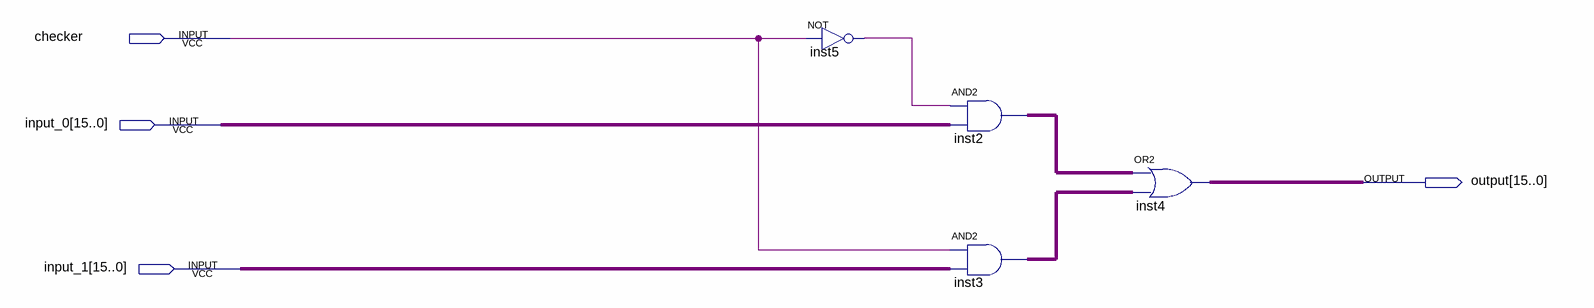
[diagram p0: schematic sheet]
// Quartus schematic 16mux.bdf as structural Verilog: 4 symbols, 4 pins
module \16mux  (
  input  \checker ,
  input  [15:0] input_0,
  input  [15:0] input_1,
  output [15:0] \output 
);

  wire inst5_out;
  wire [15:0] inst2_out, inst3_out;

  not inst5 (inst5_out, \checker );
  assign inst2_out = {16{inst5_out}} & input_0;  // AND2 inst2, 16 bits wide
  assign inst3_out = {16{\checker }} & input_1;  // AND2 inst3, 16 bits wide
  assign \output  = inst2_out | inst3_out;  // OR2 inst4, 16 bits wide
endmodule
